# Altium schematic sheet Front&Roof_Enclosure.SchDoc
size Letter; Organization: Midnight Sun Solar Rayce Car Team; Address1: University of Waterloo; Address2: 200 University Ave W; Address3: Waterloo, ON, Canada; Address4: N2L 3E9; Website: www.uwmidsun.com
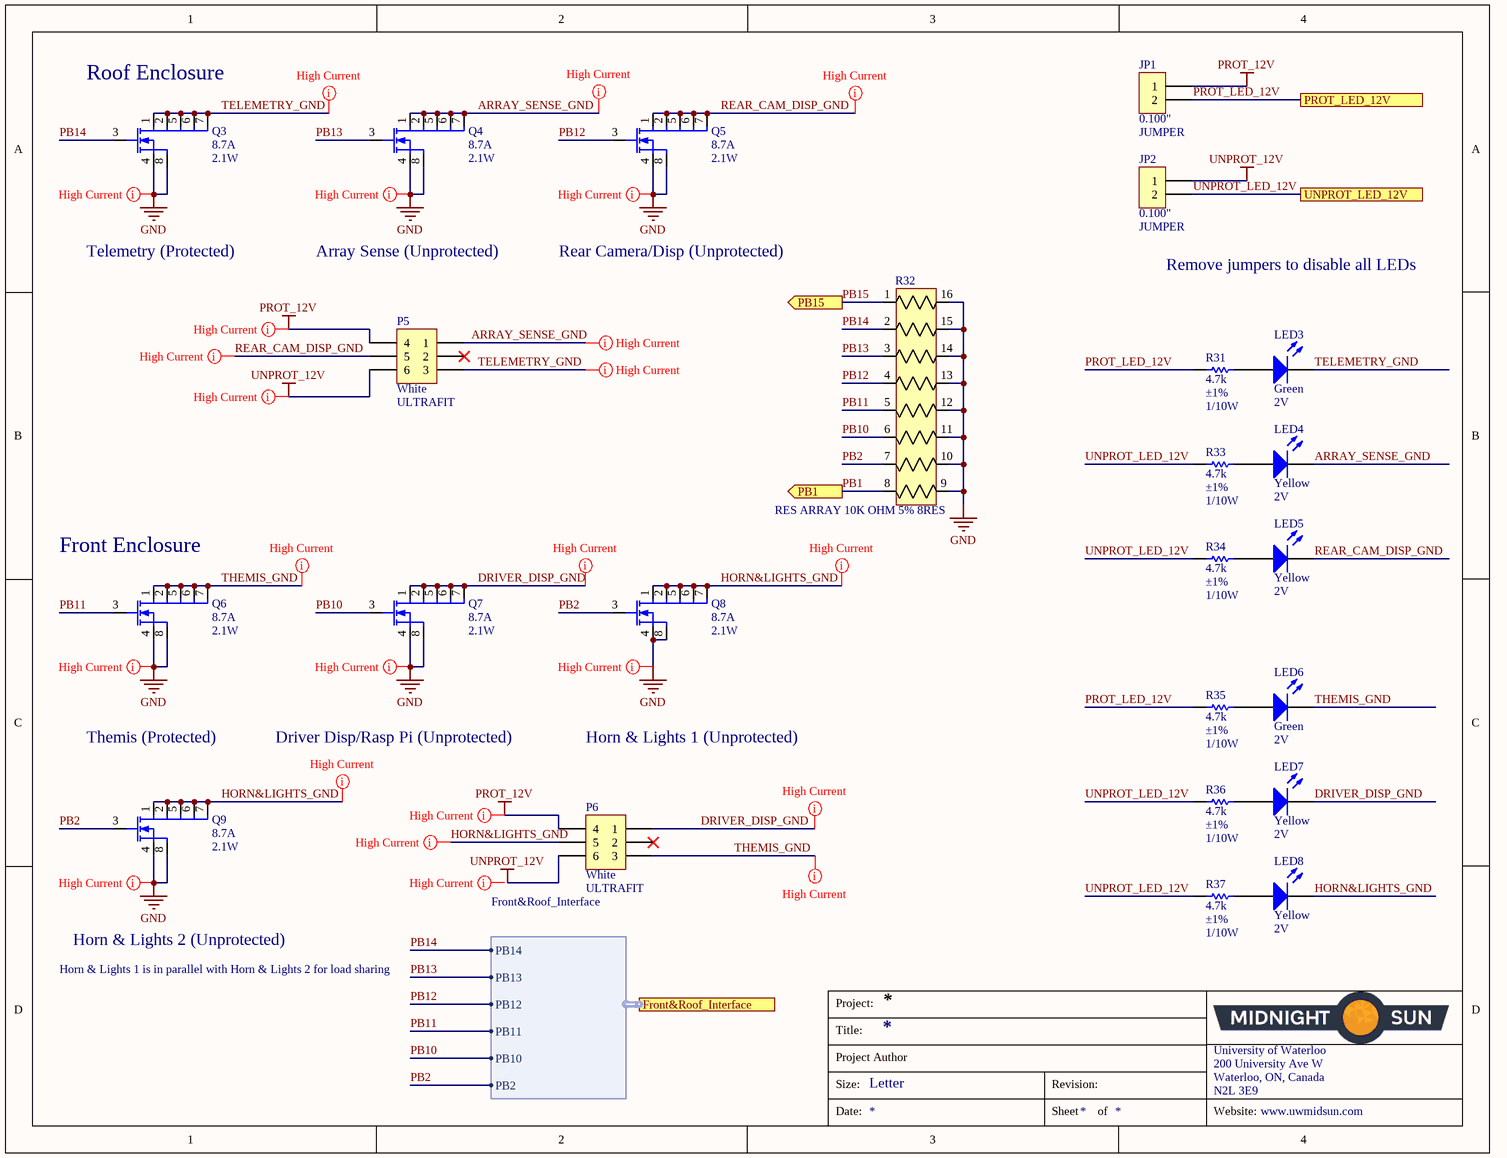
[diagram p0: Front&Roof_Enclosure.SchDoc]

## Parts
JP1  Row Spacing - Mating: 0.100"  [CONN 2POS JUMPER 0.1"]  (hidden comment: JUMPER)
JP2  Row Spacing - Mating: 0.100"  [CONN 2POS JUMPER 0.1"]  (hidden comment: JUMPER)
LED3  Color: Green  Voltage - Forward (Vf) (Typ): 2V  [LED_0603]  (hidden comment: LED GREEN CLEAR 2V 0603)
LED4  Voltage - Forward (Vf) (Typ): 2V  [LED_0603]  (hidden comment: LED YELLOW CLEAR 2.1V 0603)
LED5  Voltage - Forward (Vf) (Typ): 2V  [LED_0603]  (hidden comment: LED YELLOW CLEAR 2.1V 0603)
LED6  Color: Green  Voltage - Forward (Vf) (Typ): 2V  [LED_0603]  (hidden comment: LED GREEN CLEAR 2V 0603)
LED7  Voltage - Forward (Vf) (Typ): 2V  [LED_0603]  (hidden comment: LED YELLOW CLEAR 2.1V 0603)
LED8  Voltage - Forward (Vf) (Typ): 2V  [LED_0603]  (hidden comment: LED YELLOW CLEAR 2.1V 0603)
P5  Insulation Color: White  Series: ULTRAFIT  [CONN, 6POS ULTRA-FIT - NATURAL COLOR]  (hidden comment: CONN 6POS ULTRA-FIT NATURAL COLOR 0.138")
P6  Insulation Color: White  Series: ULTRAFIT  [CONN, 6POS ULTRA-FIT - NATURAL COLOR]  (hidden comment: CONN 6POS ULTRA-FIT NATURAL COLOR 0.138")
Q3  Current - Continuous Drain (Id) @ 25°C: 8.7A  Power Dissipation (Max): 2.1W  [MOSFET N-CH 30V 12A 2mmx2mm PQFN]  (hidden comment: MOSFET N-CH 30V 8.7A 2.1W 6-PQFN (2x2))
Q4  Current - Continuous Drain (Id) @ 25°C: 8.7A  Power Dissipation (Max): 2.1W  [MOSFET N-CH 30V 12A 2mmx2mm PQFN]  (hidden comment: MOSFET N-CH 30V 8.7A 2.1W 6-PQFN (2x2))
Q5  Current - Continuous Drain (Id) @ 25°C: 8.7A  Power Dissipation (Max): 2.1W  [MOSFET N-CH 30V 12A 2mmx2mm PQFN]  (hidden comment: MOSFET N-CH 30V 8.7A 2.1W 6-PQFN (2x2))
Q6  Current - Continuous Drain (Id) @ 25°C: 8.7A  Power Dissipation (Max): 2.1W  [MOSFET N-CH 30V 12A 2mmx2mm PQFN]  (hidden comment: MOSFET N-CH 30V 8.7A 2.1W 6-PQFN (2x2))
Q7  Current - Continuous Drain (Id) @ 25°C: 8.7A  Power Dissipation (Max): 2.1W  [MOSFET N-CH 30V 12A 2mmx2mm PQFN]  (hidden comment: MOSFET N-CH 30V 8.7A 2.1W 6-PQFN (2x2))
Q8  Current - Continuous Drain (Id) @ 25°C: 8.7A  Power Dissipation (Max): 2.1W  [MOSFET N-CH 30V 12A 2mmx2mm PQFN]  (hidden comment: MOSFET N-CH 30V 8.7A 2.1W 6-PQFN (2x2))
Q9  Current - Continuous Drain (Id) @ 25°C: 8.7A  Power Dissipation (Max): 2.1W  [MOSFET N-CH 30V 12A 2mmx2mm PQFN]  (hidden comment: MOSFET N-CH 30V 8.7A 2.1W 6-PQFN (2x2))
R31  Resistance (Ohms): 4.7k  Tolerance: ±1%  Power (Watts): 1/10W  [RES, 0603]  (hidden comment: RES 4.7K OHM 1% 1/10W 0603)
R32  RES ARRAY 10K OHM 5% 8RES  [RES ARRAY, 8 POS 1506]
R33  Resistance (Ohms): 4.7k  Tolerance: ±1%  Power (Watts): 1/10W  [RES, 0603]  (hidden comment: RES 4.7K OHM 1% 1/10W 0603)
R34  Resistance (Ohms): 4.7k  Tolerance: ±1%  Power (Watts): 1/10W  [RES, 0603]  (hidden comment: RES 4.7K OHM 1% 1/10W 0603)
R35  Resistance (Ohms): 4.7k  Tolerance: ±1%  Power (Watts): 1/10W  [RES, 0603]  (hidden comment: RES 4.7K OHM 1% 1/10W 0603)
R36  Resistance (Ohms): 4.7k  Tolerance: ±1%  Power (Watts): 1/10W  [RES, 0603]  (hidden comment: RES 4.7K OHM 1% 1/10W 0603)
R37  Resistance (Ohms): 4.7k  Tolerance: ±1%  Power (Watts): 1/10W  [RES, 0603]  (hidden comment: RES 4.7K OHM 1% 1/10W 0603)

## Ports
Front&Roof_Interface (harness Front&Roof_Interface), PB1 (out), PB15 (out), PROT_LED_12V, UNPROT_LED_12V

## Harnesses
Front&Roof_Interface: PB14, PB13, PB12, PB11, PB10, PB2

## Nets
GND: Q3.4(S) Q3.8(S) Q4.4(S) Q4.8(S) Q5.4(S) Q5.8(S) Q6.4(S) Q6.8(S) Q7.4(S) Q7.8(S) Q8.4(S) Q8.8(S) Q9.4(S) Q9.8(S) R32.9 R32.10 R32.11 R32.12 R32.13 R32.14 R32.15 R32.16
PROT_12V: JP1.1 P5.4 P6.4
UNPROT_12V: JP2.1 P5.6 P6.6
ARRAY_SENSE_GND: LED4.2(K) P5.1 Q4.1(D) Q4.2(D) Q4.5(D) Q4.6(D) Q4.7(D)
DRIVER_DISP_GND: LED7.2(K) P6.1 Q7.1(D) Q7.2(D) Q7.5(D) Q7.6(D) Q7.7(D)
HORN&LIGHTS_GND: LED8.2(K) P6.5 Q8.1(D) Q8.2(D) Q8.5(D) Q8.6(D) Q8.7(D) Q9.1(D) Q9.2(D) Q9.5(D) Q9.6(D) Q9.7(D)
PB1: R32.8 ; port PB1
PB2: Q8.3(G) Q9.3(G) R32.7 ; port Front&Roof_Interface.PB2
PB10: Q7.3(G) R32.6 ; port Front&Roof_Interface.PB10
PB11: Q6.3(G) R32.5 ; port Front&Roof_Interface.PB11
PB12: Q5.3(G) R32.4 ; port Front&Roof_Interface.PB12
PB13: Q4.3(G) R32.3 ; port Front&Roof_Interface.PB13
PB14: Q3.3(G) R32.2 ; port Front&Roof_Interface.PB14
PB15: R32.1 ; port PB15
PROT_LED_12V: JP1.2 R31.1 R35.1 ; port PROT_LED_12V
REAR_CAM_DISP_GND: LED5.2(K) P5.5 Q5.1(D) Q5.2(D) Q5.5(D) Q5.6(D) Q5.7(D)
TELEMETRY_GND: LED3.2(K) P5.3 Q3.1(D) Q3.2(D) Q3.5(D) Q3.6(D) Q3.7(D)
THEMIS_GND: LED6.2(K) P6.3 Q6.1(D) Q6.2(D) Q6.5(D) Q6.6(D) Q6.7(D)
UNPROT_LED_12V: JP2.2 R33.1 R34.1 R36.1 R37.1 ; port UNPROT_LED_12V
NetLED3_1: LED3.1(A) R31.2
NetLED4_1: LED4.1(A) R33.2
NetLED5_1: LED5.1(A) R34.2
NetLED6_1: LED6.1(A) R35.2
NetLED7_1: LED7.1(A) R36.2
NetLED8_1: LED8.1(A) R37.2

Not connected (* = marked no-connect by the designer): P5 2*; P6 2*

## Layout directives
net class HighCurrent; rule Power Plane Connect Style [Style - Direct Connect]; rule Polygon Connect Style [Style - Direct Connect]; Polygon Connect Style: Polygon Connect Style [Style - Direct Connect]: (no net found under the mark), ARRAY_SENSE_GND, DRIVER_DISP_GND, GND, HORN&LIGHTS_GND, PROT_12V, REAR_CAM_DISP_GND, TELEMETRY_GND, THEMIS_GND, UNPROT_12V

## Notes on the sheet
- (near Q3) Roof Enclosure
- Telemetry (Protected)
- Array Sense (Unprotected)
- Rear Camera/Disp (Unprotected)
- Remove jumpers to disable all LEDs
- (near LED4) Yellow
- (near Q6) Front Enclosure
- (near LED5) Yellow
- Themis (Protected)
- Driver Disp/Rasp Pi (Unprotected)
- Horn & Lights 1 (Unprotected)
- (near LED7) Yellow
- Horn & Lights 1 is in parallel with Horn & Lights 2 for load sharing
- Horn & Lights 2 (Unprotected)
- (near LED8) Yellow
- Project:
- Title:
- Size:
- Project Author
- Letter
- Revision:
- University of Waterloo
- 200 University Ave W
- Waterloo, ON, Canada
- N2L 3E9
- Date:
- Sheet
- of
- Website:

## Library data of the parts
JP1 JP2 = CONN 2POS JUMPER 0.1": 2 Positions Header Connector Through Hole Gold; Manufacturer: Omron Electronics Inc-EMC Div; Manufacturer Part Number: XG8T-0231; Style: Board to Board or Cable; Shrouding: Unshrouded; Number of Positions: 2; Number of Positions Loaded: All; Contact Length - Mating: 0.169" (4.30mm); Contact Length - Post: 0.118" (3.00mm); Overall Contact Length: 0.386" (9.80mm); Material Flammability Rating: UL94 V-0; Current Rating: 2A; Voltage Rating: 300V; Supplier 1: Digi-Key; RoHS: RoHS Compliant; Category: Connectors, Interconnects; Stock 1: 9094; Pricing 1: 1=0.28, 10=0.265, 100=0.183, 500=0.15484, 1000=0.12668, 5000=0.11261, 10000=0.10205 (CAD); Packaging: Bulk; Part Status: Active; Connector Type: Header; Contact Type: Male Pin; Pitch - Mating: -; Number of Rows: 2; Mounting Type: Through Hole; Termination: Solder; Fastening Type: -; Insulation Height: 0.098" (2.50mm); Contact Shape: Square; Contact Finish - Mating: Gold; Contact Finish Thickness - Mating: 5.9µin (0.15µm); Contact Finish - Post: Tin; Contact Material: Brass, Nickel; Insulation Material: Polybutylene Terephthalate (PBT), Glass Filled; Features: -; Operating Temperature: -55°C ~ 105°C; Ingress Protection: -; Insulation Color: Black; Mated Stacking Heights: -; Contact Finish Thickness - Post: -; Applications: -; ComponentLink1URL: http://www.omron.com/ecb/products/pdf/en-xj8.pdf; ComponentLink1Description: http://www.omron.com/ecb/products/pdf/en-xj8.pdf; Supplier Part Number 1: XG8T-0231-ND; Type: JUMPER
LED3 LED6 = LED GREEN CLEAR 2V 0603: Green 572nm LED Indication - Discrete 2V 0603 (1608 Metric); Manufacturer: Wurth Electronics Inc.; Manufacturer Part Number: 150060VS75000; Lens Color: Colorless; Millicandela Rating: 40mcd; Lens Style/Size: Rectangle with Flat Top, 1.10mm x 0.70mm; Current - Test: 20mA; Viewing Angle: 140°; Wavelength - Dominant: 570nm; Supplier 1: Digi-Key; Supplier Part Number 1: 732-4980-1-ND; Packaging: Cut Tape (CT); Part Status: Active; Lens Transparency: Clear; Mounting Type: Surface Mount; Wavelength - Peak: 572nm; Package / Case: 0603 (1608 Metric); Supplier Device Package: 0603; Size / Dimension: 1.60mm L x 0.80mm W; Height (Max): 0.80mm; ComponentLink1URL: http://katalog.we-online.de/led/datasheet/150060VS75000.pdf; ComponentLink1Description: http://katalog.we-online.de/led/datasheet/150060VS75000.pdf; Category: Optoelectronics; Features: -; Pricing 1: 1=0.21, 100=0.1617, 500=0.13964 (CAD); RoHS: RoHS Compliant; Stock 1: 9408
LED4 LED5 LED7 LED8 = LED YELLOW CLEAR 2.1V 0603: Yellow 590nm LED Indication - Discrete 2V 0603 (1608 Metric); Manufacturer: Wurth Electronics Inc.; Manufacturer Part Number: 150060YS75000; Lens Color: Colorless; Millicandela Rating: 120mcd; Lens Style/Size: Rectangle with Flat Top, 1.10mm x 0.70mm; Current - Test: 20mA; Viewing Angle: 140°; Wavelength - Peak: 595nm; Supplier 1: Digi-Key; Supplier Part Number 1: 732-4981-1-ND; RoHS: RoHS Compliant; Category: Optoelectronics; Stock 1: 10523; Pricing 1: 1=0.21, 100=0.1617, 500=0.13964 (CAD); Packaging: Cut Tape (CT); Part Status: Active; Color: Yellow; Lens Transparency: Clear; Mounting Type: Surface Mount; Wavelength - Dominant: 590nm; Features: -; Package / Case: 0603 (1608 Metric); Size / Dimension: 1.60mm L x 0.80mm W; Height (Max): 0.80mm; ComponentLink1URL: http://katalog.we-online.de/led/datasheet/150060YS75000.pdf; ComponentLink1Description: http://katalog.we-online.de/led/datasheet/150060YS75000.pdf; Supplier Device Package: 0603
P5 P6 = CONN 6POS ULTRA-FIT NATURAL COLOR 0.138": 6 Positions Header Connector 0.138" (3.50mm) Through Hole Tin; Manufacturer 1: Molex, LLC; Manufacturer Part Number 1: 1722992106; Description 1: ULTRAFIT VERT TIN PLATED NAT; Style: Board to Cable/Wire; Shrouding: Shrouded - 4 Wall; Number of Positions: 6; Number of Positions Loaded: All; Row Spacing - Mating: 0.181" (4.60mm); Contact Length - Post: 0.126" (3.20mm); Material Flammability Rating: UL94 V-0; Voltage Rating: 400V; Mated Stacking Heights: 26.99mm; Supplier 1: Digi-Key; Supplier Part Number 1: WM11799-ND; RoHS: RoHS Compliant; Category: Connectors, Interconnects; Stock 1: 315; Pricing 1: 1=1.85, 10=1.617, 50=1.4586, 100=1.395, 250=1.26816, 500=1.14134, 1000=1.01453, 2500=0.91942, 5000=0.88771 (CAD); Packaging: Tray; Part Status: Active; Connector Type: Header; Contact Type: Male Pin; Pitch - Mating: 0.138" (3.50mm); Number of Rows: 2; Mounting Type: Through Hole; Termination: Solder; Fastening Type: Latch Holder; Contact Length - Mating: -; Overall Contact Length: -; Insulation Height: 0.465" (11.80mm); Contact Shape: Square; Contact Finish - Mating: Tin; Contact Finish Thickness - Mating: 60µin (1.52µm); Contact Finish - Post: Tin; Contact Material: Copper Alloy; Insulation Material: Liquid Crystal Polymer (LCP); Features: Board Guide, Solder Retention; Operating Temperature: -40°C ~ 105°C; Ingress Protection: -; Current Rating: -; Contact Finish Thickness - Post: 60µin (1.52µm); Applications: Automotive, General Purpose, Industrial, Lighting, Medical, Military, Telecommunications; ComponentLink1URL: http://www.molex.com/pdm_docs/sd/1722992106_sd.pdf; ComponentLink1Description: http://www.molex.com/pdm_docs/sd/1722992106_sd.pdf
Q3-Q9 = MOSFET N-CH 30V 8.7A 2.1W 6-PQFN (2x2): Manufacturer 1: Infineon Technologies; Manufacturer Part Number 1: IRLHS6342TRPBF; Description 1: MOSFET N-CH 30V 8.7A 2X2 PQFN; FET Type: N-Channel; Drive Voltage (Max Rds On,  Min Rds On): 2.5V, 4.5V; Vgs(th) (Max) @ Id: 1.1V @ 10µA; Gate Charge (Qg) (Max) @ Vgs: 11nC @ 4.5V; Input Capacitance (Ciss) (Max) @ Vds: 1019pF @ 25V; Vgs (Max): ±12V; Rds On (Max) @ Id, Vgs: 15.5 mOhm @ 8.5A, 4.5V; Supplier 1: Digi-Key; Supplier Part Number 1: IRLHS6342TRPBFCT-ND; RoHS: RoHS Compliant; Category: Discrete Semiconductor Products; Stock 1: 9984; Pricing 1: 1=0.79, 10=0.685, 100=0.5118, 500=0.4022, 1000=0.31079 (CAD); Packaging: Cut Tape (CT); Part Status: Active; Technology: MOSFET (Metal Oxide); Drain to Source Voltage (Vdss): 30V; FET Feature: -; Operating Temperature: -55°C ~ 150°C (TJ); Mounting Type: Surface Mount; Supplier Device Package: 6-PQFN (2x2); Package / Case: 6-PowerVDFN; ComponentLink1URL: http://www.infineon.com/dgdl/irlhs6342pbf.pdf?fileId=5546d462533600a401535663b52625ad; ComponentLink1Description: http://www.infineon.com/dgdl/irlhs6342pbf.pdf?fileId=5546d462533600a401535663b52625ad
R31 R33-R37 = RES 4.7K OHM 1% 1/10W 0603: 4.7k Ohm ±1% 0.1W, 1/10W Chip Resistor 0603 (1608 Metric) Moisture Resistant Thick Film; Manufacturer 1: Yageo; Manufacturer Part Number 1: RC0603FR-074K7L; Description 1: RES SMD 4.7K OHM 1% 1/10W 0603; Temperature Coefficient: ±100ppm/°C; Supplier 1: Digi-Key; Supplier Part Number 1: 311-4.70KHRCT-ND; RoHS: RoHS Compliant; Category: Resistors; Stock 1: 3487566; Pricing 1: 1=0.16, 10=0.022, 100=0.0089, 1000=0.00402, 2500=0.00349 (CAD); Packaging: Cut Tape (CT); Part Status: Active; Composition: Thick Film; Features: Moisture Resistant; Operating Temperature: -55°C ~ 155°C; Package / Case: 0603 (1608 Metric); Supplier Device Package: 0603; Size / Dimension: 0.063" L x 0.031" W (1.60mm x 0.80mm); Height - Seated (Max): 0.022" (0.55mm); Failure Rate: -; ComponentLink1URL: http://www.yageo.com/documents/recent/PYu-RC_Group_51_RoHS_L_7.pdf; ComponentLink1Description: http://www.yageo.com/documents/recent/PYu-RC_Group_51_RoHS_L_7.pdf
R32 = RES ARRAY 10K OHM 5% 8RES EXB-2HV103JV: RES ARRAY SMD 10K 5% 62.5mW 1506; Manufacturer: Panasonic Electronic Components; Vendor: Panasonic; C: Copyright (C) 2015 Accelerated Designs. All rights reserved; Circuit Type: Isolated; Temperature Coefficient: ±200ppm/°C; Value: Value; Copyright: Copyright (C) 2015 Accelerated Designs. All rights reserved; Manufacturer_Part_Number: EXB-2HV103JV; Supplier 1: Digi-Key; Manufacturer Part Number: EXB-2HV103JV; RoHS: RoHS Compliant; Category: Resistors; Stock 1: 152779; Pricing 1: 1=0.43, 10=0.373, 25=0.2712, 50=0.1964, 100=0.1456, 250=0.11176, 500=0.08806, 1000=0.06096 (CAD); Packaging: Cut Tape (CT); Part Status: Active; Resistance (Ohms): 10k; Tolerance: ±5%; Power Per Element: 62.5mW; Operating Temperature: -55°C ~ 125°C; Applications: Automotive AEC-Q200; Mounting Type: Surface Mount; Package / Case: 1506, Convex, Long Side Terminals; Supplier Device Package: 1506; Size / Dimension: 0.150" L x 0.063" W (3.80mm x 1.60mm); Height - Seated (Max): 0.022" (0.55mm); ComponentLink1URL: https://industrial.panasonic.com/cdbs/www-data/pdf/AOC0000/AOC0000C14.pdf; ComponentLink1Description: https://industrial.panasonic.com/cdbs/www-data/pdf/AOC0000/AOC0000C14.pdf; Supplier Part Number 1: Y1103CT-ND